# EAGLE design stepper (EAGLE 6.5.0)
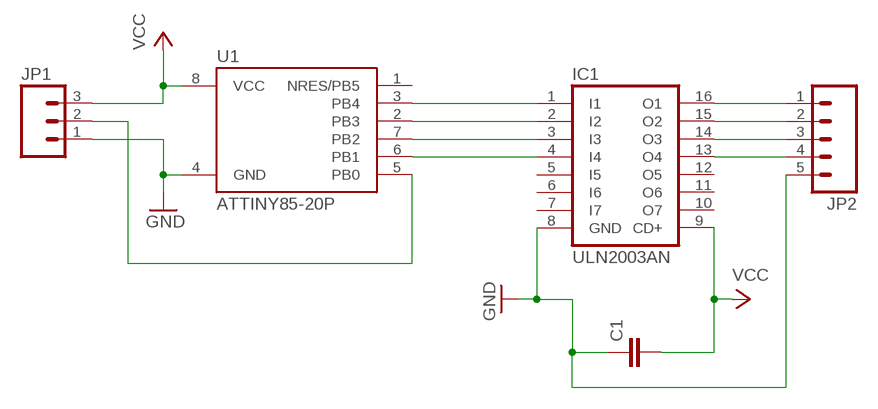
[diagram p0: schematic, sheet 1]

## Parts
C1  C-EU025-025X050  [C025-025X050]
IC1  ULN2003AN  [DIL16]
JP1  M03JST-PTH  [JST-3-PTH]
JP2  M05PTH_LONGPADS  [1X05_LONGPADS]
U1  ATTINY85-20P  [PDIP08_300MIL]

## Nets
GND: C1.1 IC1.8(GND) JP1.1 JP2.5 U1.4(GND)
N$1: IC1.1(I1) U1.3(PB4)
N$2: IC1.2(I2) U1.2(PB3)
N$3: IC1.3(I3) U1.7(PB2)
N$4: IC1.4(I4) U1.6(PB1)
N$5: JP1.2 U1.5(PB0)
N$6: IC1.16(O1) JP2.1
N$7: IC1.15(O2) JP2.2
N$8: IC1.14(O3) JP2.3
N$9: IC1.13(O4) JP2.4
VCC: C1.2 IC1.9(CD+) JP1.3 U1.8(VCC)
Unconnected: IC1.5(I5) IC1.6(I6) IC1.7(I7) IC1.10(O7) IC1.11(O6) IC1.12(O5) U1.1(NRES/PB5)

## Library data of the parts
C1 = rcl:C-EU: CAPACITOR, European symbol
IC1 = uln-udn:ULN2003A: DRIVER ARRAY
JP1 = SparkFun-Connectors:M03: Header 3 Standard 3-pin 0.1" header. Use with straight break away headers (SKU : PRT-00116), right angle break away headers (PRT-00553), swiss pins (PRT-00743), machine pins (PRT-00117), and female headers (PRT-00115). Molex polarized connector foot print use with SKU : PRT-08232 with associated crimp pins and housings.; SKU: PRT-09915
JP2 = SparkFun-Connectors:M05: Header 5 Standard 5-pin 0.1" header. Use with straight break away headers (SKU : PRT-00116), right angle break away headers (PRT-00553), swiss pins (PRT-00743), machine pins (PRT-00117), and female headers (PRT-00115). Molex polarized connector foot print use with SKU : PRT-08230 with associated crimp pins and housings.
U1 = attiny25_45_85:ATTINY85*: ATMEL ATtiny 85 Packages: P = PDIP 08 30mil S = SOIC 08 EIAJ 208mil Technologies Note: for complete ordering code (temp. range, finish, tape&reel etc.) see www.atmel.com • Supply Voltage: V = (1.8…5.5)V | [blank] = (2.7…5.5)V • Speed: 10 = 10 MHz | 20 = 20 MHz Author: Dipl.-Ing. FH Rainer Bayer HHN Hochschule Heilbronn (Heilbronn University), rainer.bayer@hs-heilbronn.de Ingenieurbüro ing-rb, mail@ing-rb.de

## Board
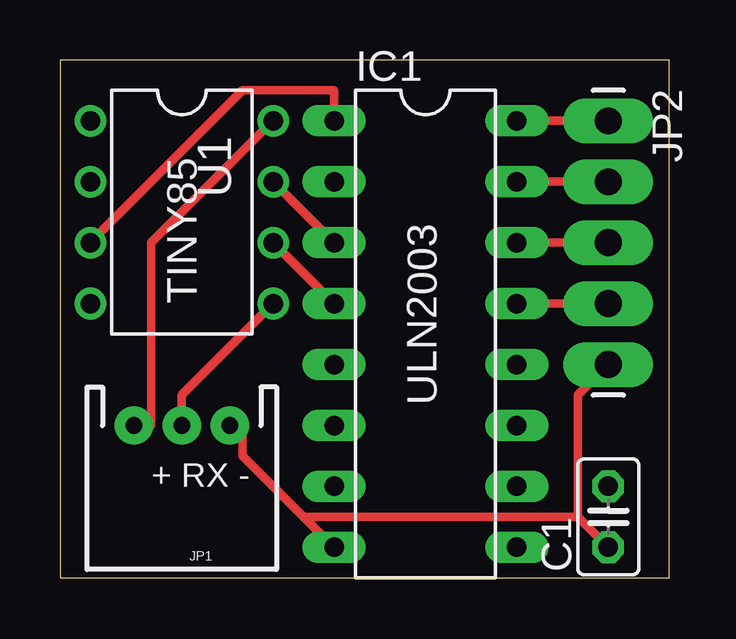
[diagram p1: board, top side]
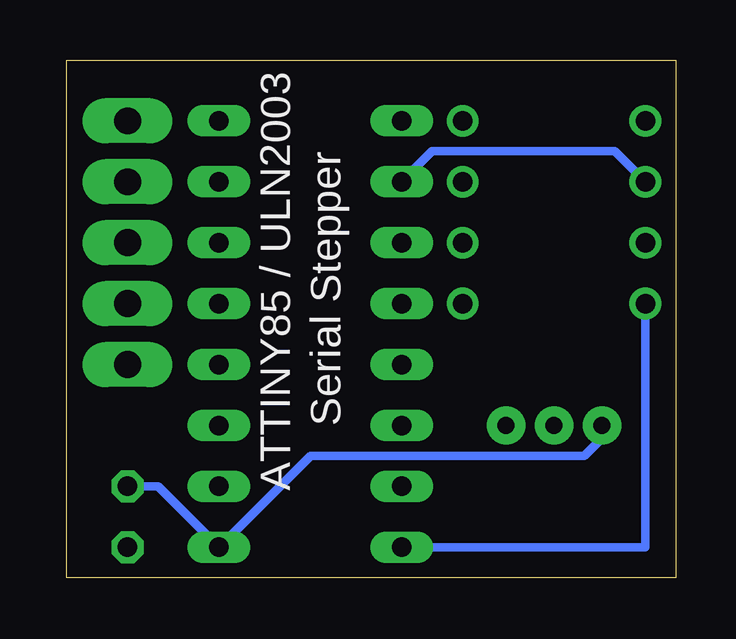
[diagram p2: board, bottom side, seen from below]

Size 25.4 x 21.59 mm. Coordinates in mm from the lower left corner, seen from the top.
Outline: 0,0 25.4,0 25.4,21.59 0,21.59 0,0
Copper layers (1*16): Top 0.035mm / dielectric 1.5mm / Bottom 0.035mm
Design rules "SeeedStudio_2layer_DRU_no_angle_20140221": minimum track width 6mil, minimum drill 12mil, track to track 6mil, track to pad 6mil, pad to pad 6mil, via to via 6mil, smd to smd 0mil, copper to edge 10mil, drill to drill 10mil, minimum pad ring 10mil, minimum via ring 6mil, stop-mask expansion 2mil, vias tented up to drill 100mil, thermal gap 10mil

### Footprints (pad centres in the part's own frame; a part is rotated, then mirrored left to right if it is on the bottom)
C025-025X050 = drill 0.813 octagon: 1 -1.27,0; 2 1.27,0
DIL16 = drill 0.813 long: 1 -8.89,-3.81; 2 -6.35,-3.81; 3 -3.81,-3.81; 4 -1.27,-3.81; 5 1.27,-3.81; 6 3.81,-3.81; 7 6.35,-3.81; 8 8.89,-3.81; 9 8.89,3.81; 10 6.35,3.81; 11 3.81,3.81; 12 1.27,3.81; 13 -1.27,3.81; 14 -3.81,3.81; 15 -6.35,3.81; 16 -8.89,3.81
JST-3-PTH = drill 0.7 pad 1.6: 1 -2,0; 2 0,0; 3 2,0
1X05_LONGPADS = drill 1.118 pad 1.88 long: 1 0,0; 2 2.54,0; 3 5.08,0; 4 7.62,0; 5 10.16,0
PDIP08_300MIL = drill 0.813: 1 -3.81,-3.81; 2 -1.27,-3.81; 3 1.27,-3.81; 4 3.81,-3.81; 5 3.81,3.81; 6 1.27,3.81; 7 -1.27,3.81; 8 -3.81,3.81

### Placement (x,y rotation side)
C1  22.86,2.54 90 top
IC1  15.24,10.16 270 top
JP1  5.08,6.35 180 top
JP2  22.86,19.05 270 top
U1  5.08,15.24 270 top

### Tracks (layer width: path | path; a pad name or v marks a point on that pad's centre or on a via)
GND
  Top 0.356: 21.59,2.54 C1.1 | 21.59,2.54 21.59,7.62 JP2.5 | 10.16,2.54 7.62,5.08 7.62,6.35 JP1.1 | 10.16,2.54 IC1.8 | 10.16,2.54 21.59,2.54
  Bottom 0.356: U1.4 1.27,1.27 IC1.8
N$1
  Top 0.356: U1.3 7.62,20.32 11.43,20.32 IC1.1
N$2
  Bottom 0.356: U1.2 2.54,17.78 10.16,17.78 IC1.2
N$3
  Top 0.356: U1.7 IC1.3
N$4
  Top 0.356: U1.6 IC1.4
N$5
  Top 0.356: U1.5 5.08,7.62 JP1.2
N$6
  Top 0.356: JP2.1 IC1.16
N$7
  Top 0.356: JP2.2 IC1.15
N$8
  Top 0.356: JP2.3 IC1.14
N$9
  Top 0.356: JP2.4 IC1.13
VCC
  Top 0.356: U1.8 3.81,13.97 3.81,6.35 JP1.3
  Bottom 0.356: C1.2 21.59,3.81 IC1.9 15.24,5.08 3.81,5.08 2.54,6.35 JP1.3

### Text on the board
_tsilk: TINY85 | ULN2003 | + RX -
_bsilk: ATTINY85 / ULN2003 | Serial Stepper